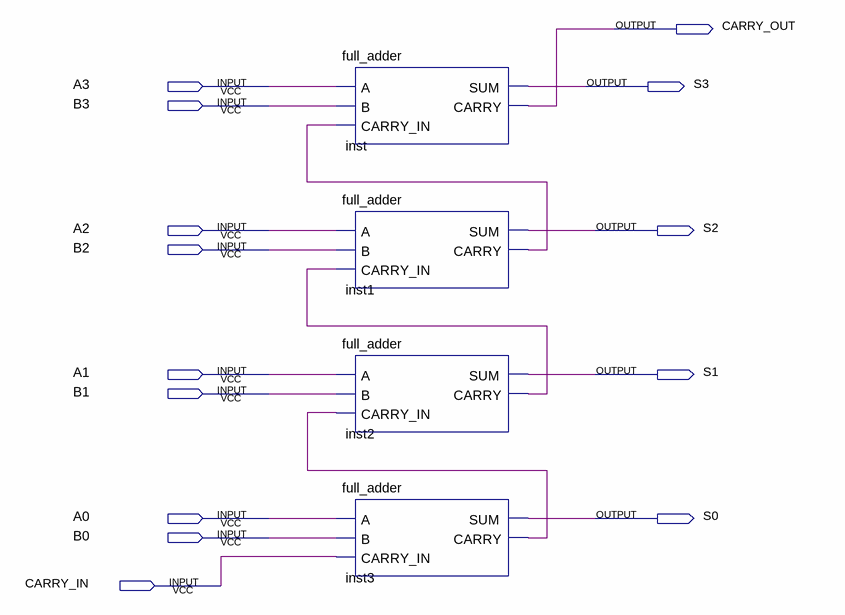
[diagram p0: schematic sheet]
// Quartus schematic carry_ripple.bdf as structural Verilog: 4 symbols, 14 pins
module carry_ripple (
  input  A3,
  input  B3,
  input  A2,
  input  B2,
  input  A1,
  input  B1,
  input  A0,
  input  B0,
  input  CARRY_IN,
  output CARRY_OUT,
  output S3,
  output S2,
  output S1,
  output S0
);

  wire inst1_carry, inst2_carry, inst3_carry;

  full_adder inst (.A(A3), .B(B3), .CARRY_IN(inst1_carry), .SUM(S3), .CARRY(CARRY_OUT));
  full_adder inst1 (.A(A2), .B(B2), .CARRY_IN(inst2_carry), .SUM(S2), .CARRY(inst1_carry));
  full_adder inst2 (.A(A1), .B(B1), .CARRY_IN(inst3_carry), .SUM(S1), .CARRY(inst2_carry));
  full_adder inst3 (.A(A0), .B(B0), .CARRY_IN(CARRY_IN), .SUM(S0), .CARRY(inst3_carry));
endmodule
